# Altium schematic sheet ST_LINK.SCHDOC
size A4; Revision: C.2(PCB.SCH)
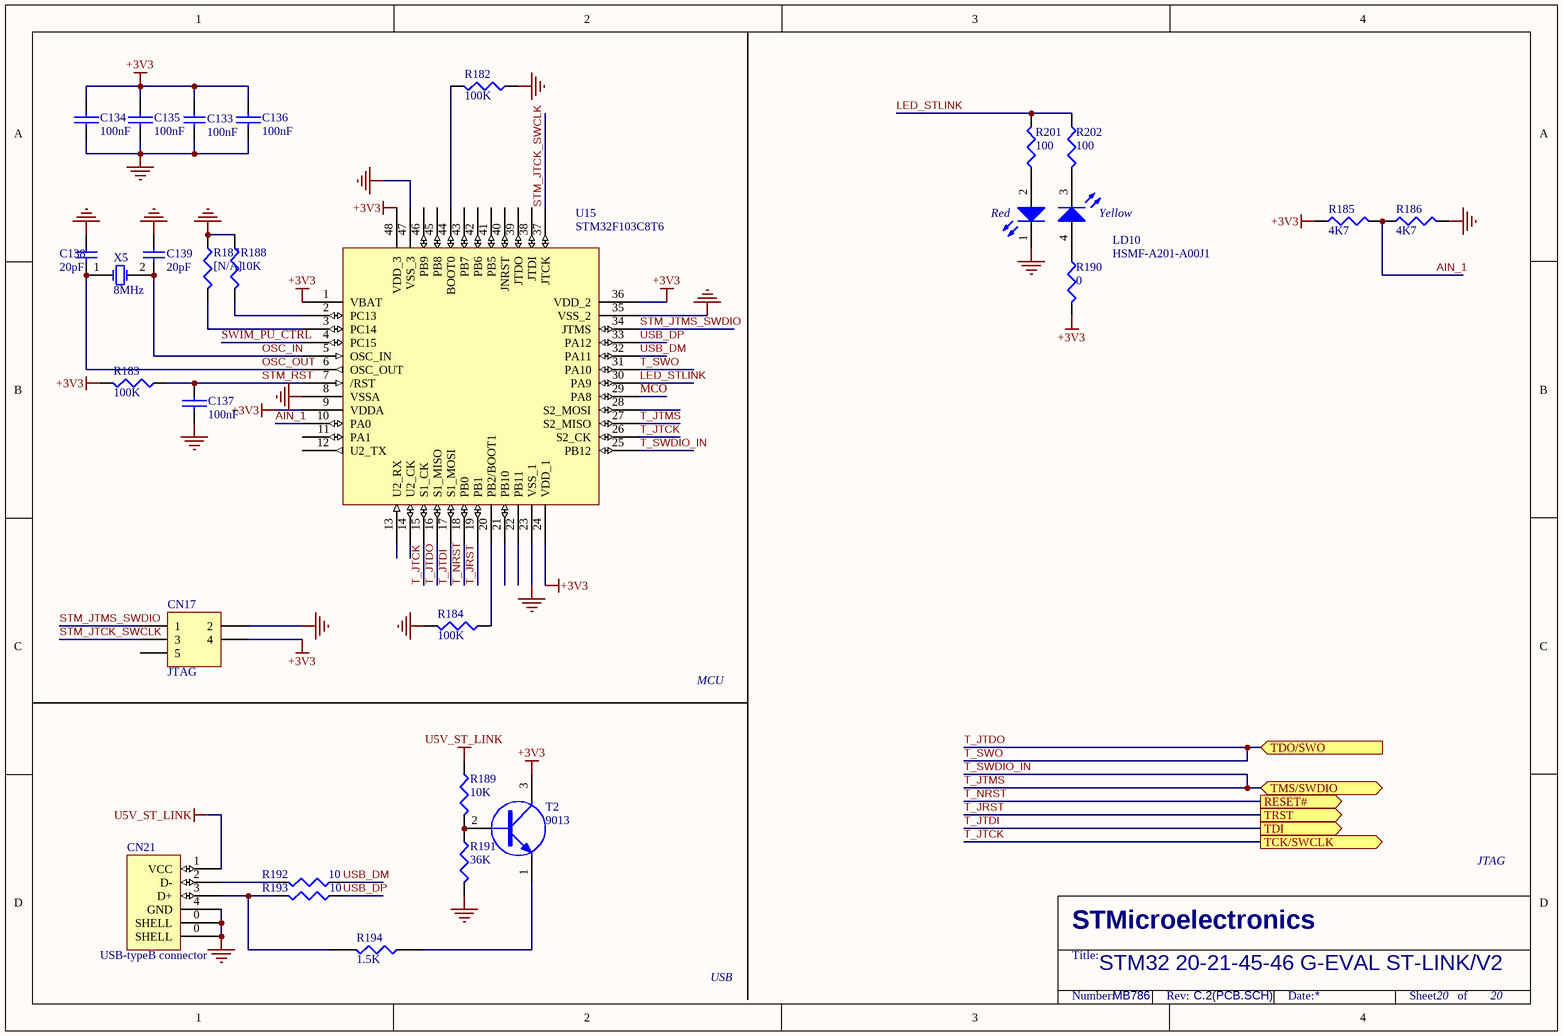
[diagram p0: ST_LINK.SCHDOC]

## Parts
C133  100nF  [0402C]
C134  100nF  [0402C]
C135  100nF  [0402C]
C136  100nF  [0402C]
C137  100nF  [0402C]
C138  value 20pF  [0603C]  (hidden comment: Cap)
C139  value 20pF  [0603C]  (hidden comment: Cap)
CN17  JTAG  [HDR2X3]
CN21  USB-typeB connector  [USB-B]
LD10  HSMF-A201-A00J1
R182  100K  [0402R]
R183  100K  [0402R]
R184  100K  [0402R]
R185  4K7  [0402R]
R186  4K7  [0402R]
R187  [N/A]  [0603R]
R188  10K  [0402R]
R189  10K  [0402R]
R190  0  [0603R]
R191  36K  [0603R]
R192  10  [0603R]
R193  10  [0603R]
R194  1.5K  [0603R]
R201  100  [0603R]
R202  100  [0603R]
T2  9013  [SOT-23]
U15  STM32F103C8T6  [LQFP48]
X5  8MHz  [SMT_XTAL]

## Ports
RESET# (out), TCK/SWCLK (out), TDI (out), TDO/SWO (in), TMS/SWDIO (bidir), TRST (out)

## Nets
+3V3: C133.1 C134.2 C135.2 C136.2 CN17.4 R183.2 R185.1 R190.2 T2.3(C) U15.1(VBAT) U15.9(VDDA) U15.24(VDD_1) U15.36(VDD_2) U15.48(VDD_3)
GND: C133.2 C134.1 C135.1 C136.1 C137.1 C138.1 C139.1 CN17.2 CN21.0(SHELL) CN21.4(GND) LD10.1(RED_cathode) R182.1 R184.2 R186.2 R187.1 R188.1 R191.2 U15.8(VSSA) U15.23(VSS_1) U15.35(VSS_2) U15.47(VSS_3)
U5V_ST_LINK: CN21.1(VCC) R189.1
AIN_1: R185.2 R186.1 U15.10(PA0)
LED_STLINK: R201.2 R202.1 U15.30(PA9)
MCO: U15.29(PA8)
OSC_IN: C139.2 U15.5(OSC_IN) X5.2(OSC2)
OSC_OUT: C138.2 U15.6(OSC_OUT) X5.1(OSC1)
STM_JTCK_SWCLK: CN17.3 U15.37(JTCK)
STM_JTMS_SWDIO: CN17.1 U15.34(JTMS)
STM_RST: C137.2 R183.1 U15.7(/RST)
SWIM_PU_CTRL: U15.4(PC15)
T_JRST: U15.19(PB1) ; port TRST
T_JTCK: U15.15(S1_CK) U15.26(S2_CK) ; port TCK/SWCLK
T_JTDI: U15.17(S1_MOSI) ; port TDI
T_JTDO: U15.16(S1_MISO) U15.31(PA10) ; port TDO/SWO  [also labelled T_SWO]
T_JTMS: U15.25(PB12) U15.27(S2_MISO) ; port TMS/SWDIO  [also labelled T_SWDIO_IN]
T_NRST: U15.18(PB0) ; port RESET#
USB_DM: R192.1 U15.32(PA11)
USB_DP: R193.1 U15.33(PA12)
NetCN21_2: CN21.2(D-) R192.2
NetCN21_3: CN21.3(D+) R193.2 R194.2
NetLD10_2: LD10.2(Red_anode) R201.1
NetLD10_3: LD10.3(YellowGreen_cathode) R202.2
NetLD10_4: LD10.4(YellowGreen_anode) R190.1
NetR182_2: R182.2 U15.44(BOOT0)
NetR184_1: R184.1 U15.20(PB2/BOOT1)
NetR187_2: R187.2 U15.3(PC14)
NetR188_2: R188.2 U15.2(PC13)
NetR189_2: R189.2 R191.1 T2.2(B)
NetR194_1: R194.1 T2.1(E)

Not connected (* = marked no-connect by the designer): CN17 5; U15 11(PA1) 12(U2_TX) 13(U2_RX) 14(U2_CK) 21(PB10) 22(PB11) 28(S2_MOSI) 38(JTDI) 39(JTDO) 40(JNRST) 41(PB5) 42(PB6) 43(PB7) 45(PB8) 46(PB9)

## Notes on the sheet
- MCU
- JTAG
- USB
- STM32 20-21-45-46 G-EVAL ST-LINK/V2
- MB786
- 20
- STMicroelectronics
- Title:
- Number:
- Rev:
- Date:
- Sheet       of
- (in symbol HSMF-A201-A00J1) Red; Yellow

## Library data of the parts
C133 = Cap: Capacitor; Value: 10nF; Published: 8-Jun-2000; Revision: July-2002: Re-released for DXP Platform.; Publisher: Altium Limited
C134-C137 = CAP
C138 C139 = Cap: Capacitor; Published: 8-Jun-2000; LatestRevisionDate: 17-Jul-2002; LatestRevisionNote: Re-released for DXP Platform.; PackageReference: RAD-0.3; Publisher: Altium Limited
CN17 = Header 3X2: Header, 3-Pin, Dual row; Revision: 17-Jul-2002: Re-released for DXP Platform.; Publisher: Altium Limited
R182-R186 R190 R192-R194 R201 R202 = RES1
R187-R189 R191 = R: Right: 20; Bottom: 30
T2 = NPN
U15 = STM32F10x(48pin)
X5 = XTAL: Crystal Oscillator; Published: 8-Jun-2000; LatestRevisionDate: 17-Jul-2002; LatestRevisionNote: Re-released for DXP Platform.; PackageReference: R38; Publisher: Altium Limited